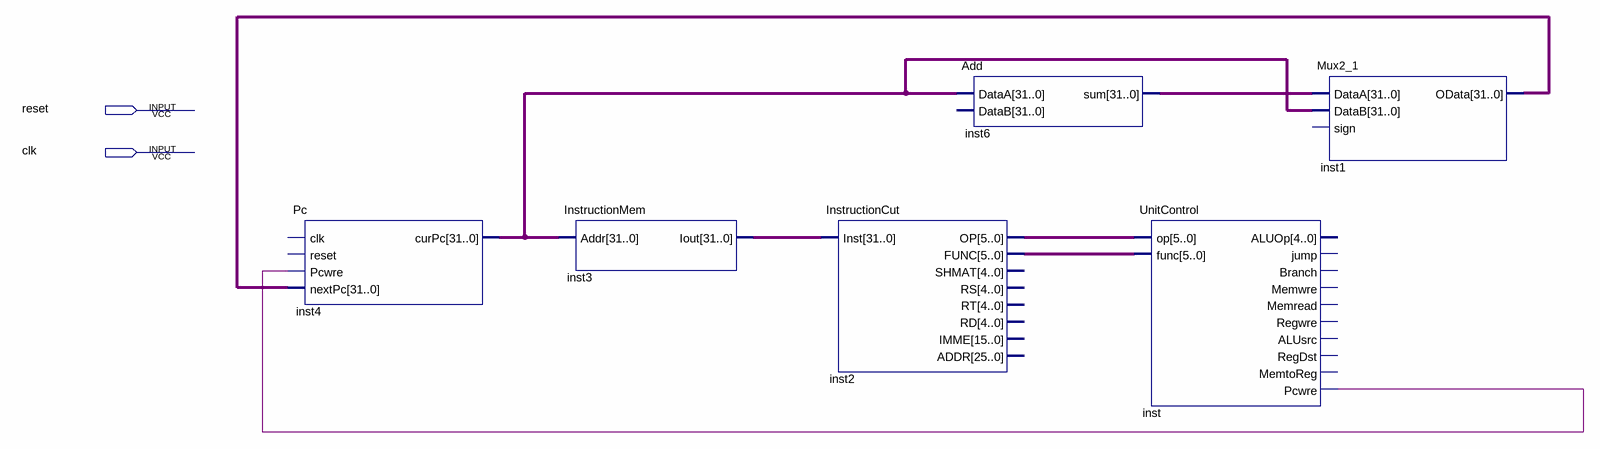
[diagram p0: schematic sheet]
// Quartus schematic Cpu_j.bdf as structural Verilog: 6 symbols, 2 pins
module Cpu_j (
  input  reset,
  input  clk
);

  wire inst_pcwre;
  wire [5:0] inst2_func, inst2_op;
  wire [31:0] inst1_odata, inst3_iout, inst4_curpc, inst6_sum;

  Pc inst4 (.Pcwre(inst_pcwre), .nextPc(inst1_odata), .curPc(inst4_curpc));  // open: clk, reset
  InstructionMem inst3 (.Addr(inst4_curpc), .Iout(inst3_iout));
  InstructionCut inst2 (.Inst(inst3_iout), .OP(inst2_op), .FUNC(inst2_func));  // open: SHMAT, RS, RT, RD, IMME, ADDR
  Add inst6 (.DataA(inst4_curpc), .sum(inst6_sum));  // open: DataB
  UnitControl inst (
    .op(inst2_op), .func(inst2_func), .Pcwre(inst_pcwre));  // open: ALUOp, jump, Branch, Memwre, Memread, Regwre, ALUsrc, RegDst, MemtoReg
  Mux2_1 inst1 (.DataA(inst6_sum), .DataB(inst4_curpc), .OData(inst1_odata));  // open: sign
endmodule
